# EAGLE design tdlf_server (EAGLE 9.6.2)
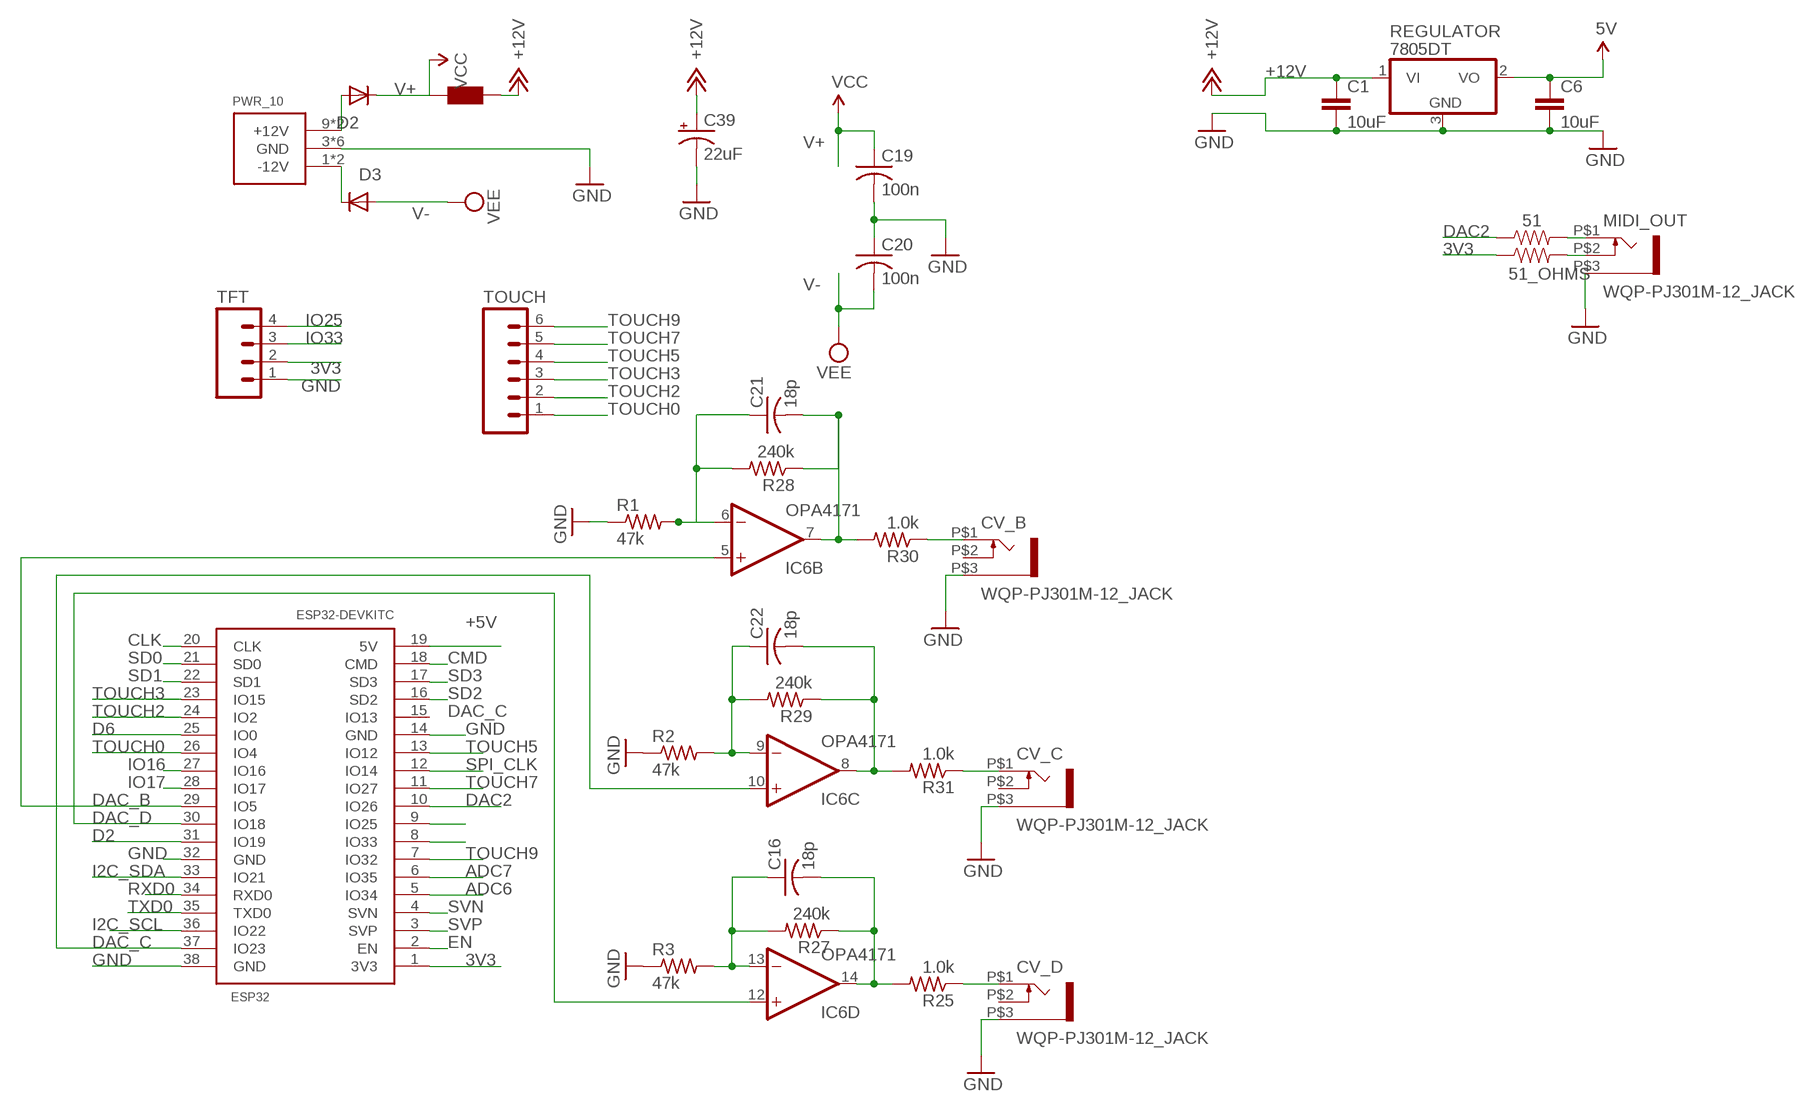
[diagram p0: schematic, sheet 1]

## Parts
51  RESISTOR1206  [1206]
51_OHMS  RESISTOR1206  [1206]
C1  10uF  CAPACITOR1210  [R1210]
C6  10uF  CAPACITOR1210  [R1210]
C16  18p  C-USC0603  [C0603]
C19  100n  C-USC0603  [C0603]
C20  100n  C-USC0603  [C0603]
C21  18p  C-USC0603  [C0603]
C22  18p  C-USC0603  [C0603]
C39  22uF  CAP_POL1206_TANT  [1206_POL]
CV_B  WQP-PJ301M-12_JACK  [WQP-PJ301M-12_JACK]
CV_C  WQP-PJ301M-12_JACK  [WQP-PJ301M-12_JACK]
CV_D  WQP-PJ301M-12_JACK  [WQP-PJ301M-12_JACK]
D2  B0450  DIODE-SOD123  [SOD123]
D3  B0540  DIODE-SOD123  [SOD123]
ESP32  ESP32DEVKITC  [ESP32-DEVKITC]
F1  Würth Electronics 742792664  FERRITE-BEAD0805  [R0805]
IC6  OPA4171  TL074D  [SO14]
MIDI_OUT  WQP-PJ301M-12_JACK  [WQP-PJ301M-12_JACK]
PWR_10  POWER_SIMPLE10  [POWER_10]
R1  47k  R-US_R1206  [R1206]
R2  47k  R-US_R1206  [R1206]
R3  47k  R-US_R1206  [R1206]
R25  1.0k  R-US_R0603  [R0603]
R27  240k  R-US_R0603  [R0603]
R28  240k  R-US_R0603  [R0603]
R29  240k  R-US_R0603  [R0603]
R30  1.0k  R-US_R0603  [R0603]
R31  1.0k  R-US_R0603  [R0603]
REGULATOR  7805DT  [TO252]
TFT  M04PTH  [1X04]
TOUCH  M06LOCK_LONGPADS  [1X06_LOCK_LONGPADS]

## Nets
3V: 51_OHMS.2 MIDI_OUT.P$2
3V3: 51_OHMS.1 ESP32.1(3V3) TFT.2
+5V: C6.1 ESP32.19(5V) REGULATOR.2(VO) ; supply symbol labelled 5V
+12V: C1.1 C39.2(+) F1.1 REGULATOR.1(VI)
ADC6: ESP32.5(IO34)
ADC7: ESP32.6(IO35)
CLK: ESP32.20(CLK)
CMD: ESP32.18(CMD)
D2: ESP32.31(IO19)
D6: ESP32.25(IO0)
DAC2: 51.1 ESP32.10(IO26)
DAC_B: ESP32.29(IO5) IC6.5(B:+IN)
DAC_C: ESP32.37(IO23) IC6.10(C:+IN)
DAC_D: ESP32.30(IO18) IC6.12(D:+IN)
EN: ESP32.2(EN)
GND: C1.2 C6.2 C19.2 C20.1 C39.1(-) CV_B.P$3 CV_C.P$3 CV_D.P$3 ESP32.14(GND) ESP32.32(GND) ESP32.38(GND) MIDI_OUT.P$3 PWR_10.3(GND) PWR_10.4(GND) PWR_10.5(GND) PWR_10.6(GND) PWR_10.7(GND) PWR_10.8(GND) R1.1 R2.1 R3.1 REGULATOR.3(GND) TFT.1
I2C_SCL: ESP32.36(IO22)
I2C_SDA: ESP32.33(IO21)
IO16: ESP32.27(IO16)
IO17: ESP32.28(IO17)
IO25: ESP32.9(IO25) TFT.4
IO33: ESP32.8(IO33) TFT.3
N$1: D3.C PWR_10.1(-12V) PWR_10.2(-12V)
N$2: C22.1 IC6.9(C:-IN) R2.2 R29.2
N$3: CV_C.P$1 R31.1
N$4: D2.A PWR_10.9(+12V) PWR_10.10(+12V)
N$5: CV_D.P$1 R25.1
N$50: C21.2 IC6.7(B:OUT) R28.1 R30.2
N$51: C22.2 IC6.8(C:OUT) R29.1 R31.2
N$52: C16.2 IC6.14(D:OUT) R25.2 R27.1
N$59: C16.1 IC6.13(D:-IN) R3.2 R27.2
N$60: C21.1 IC6.6(B:-IN) R1.2 R28.2
N$63: CV_B.P$1 R30.1
PIN27: 51.2 MIDI_OUT.P$1
RXD0: ESP32.34(RXD0)
SD0: ESP32.21(SD0)
SD1: ESP32.22(SD1)
SD2: ESP32.16(SD2)
SD3: ESP32.17(SD3)
SPI_CLK: ESP32.12(IO14)
SVN: ESP32.4(SVN)
SVP: ESP32.3(SVP)
TOUCH0: ESP32.26(IO4) TOUCH.1
TOUCH2: ESP32.24(IO2) TOUCH.2
TOUCH3: ESP32.23(IO15) TOUCH.3
TOUCH5: ESP32.13(IO12) TOUCH.4
TOUCH7: ESP32.11(IO27) TOUCH.5
TOUCH9: ESP32.7(IO32) TOUCH.6
TXD0: ESP32.35(TXD0)
V+: C19.1 D2.C F1.2 ; supply symbol labelled VCC
V-: C20.2 D3.A ; supply symbol labelled VEE
Unconnected: CV_B.P$2 CV_C.P$2 CV_D.P$2 ESP32.15(IO13) IC6.1(A:OUT) IC6.2(A:-IN) IC6.3(A:+IN)

## Power pins joined to a net without a drawn wire
V+: IC6.4(P:V+)
V-: IC6.11(P:V-)

## Library data of the parts
51 51_OHMS = SparkFun-Resistors:RESISTOR: Generic Resistor Package
C1 C6 = parts_aman:CAPACITOR
C16 C19-C22 = rcl:C-US: CAPACITOR, American symbol
C39 = parts_aman:CAP_POL
CV_B CV_C CV_D MIDI_OUT = thonkiconn:WQP-PJ301M-12_JACK
D2 D3 = diode:DIODE-: DIODE
ESP32 = ESP32-DEVKITC:ESP32DEVKITC
F1 = parts_aman:FERRITE-BEAD
IC6 = gm-ics:TL074: OP AMP
PWR_10 = parts_aman:POWER_SIMPLE
R1-R3 = rcl:R-US_: RESISTOR, American symbol; SPICEPREFIX: R
R25 R27-R31 = rcl:R-US_: RESISTOR, American symbol
REGULATOR = linear:78*: Positive VOLTAGE REGULATOR Source: http://cache.national.com/ds/LM/LM78L05.pdf http://www.fairchildsemi.com/ds/LM/LM7805.pdf
TFT = SparkFun-Connectors:M04: Header 4 Standard 4-pin 0.1" header. Use with straight break away headers (SKU : PRT-00116), right angle break away headers (PRT-00553), swiss pins (PRT-00743), machine pins (PRT-00117), and female headers (PRT-00115). Molex polarized connector foot print use with SKU : PRT-08231 with associated crimp pins and housings. 1MM SMD Version SKU: PRT-10208
TOUCH = SparkFun-Connectors:M06: Header 6 Standard 6-pin 0.1" header. Use with straight break away headers (SKU : PRT-00116), right angle break away headers (PRT-00553), swiss pins (PRT-00743), machine pins (PRT-00117), and female headers (PRT-00115). Molex polarized connector foot print use with SKU : PRT-08094 with associated crimp pins and housings. NOTES ON THE VARIANTS LOCK and LOCK_LONGPADS... This footprint was designed to help hold the alignment of a through-hole component (i.e. 6-pin header) while soldering it into place. You may notice that each hole has been shifted either up or down by 0.005 of an inch from it's more standard position (which is a perfectly straight line). This slight alteration caused the pins (the squares in the middle) to touch the edges of the holes. Because they are alternating, it causes a "brace" to hold the component in place. 0.005 has proven to be the perfect amount of "off-center" position when using our standard breakaway headers. Although looks a little odd when you look at the bare footprint, once you have a header in there, the alteration is very hard to notice. Also,if you push a header all the way into place, it is covered up entirely on the bottom side. This idea of altering the position of holes to aid alignment will be further integrated into the Sparkfun Library for other footprints. It can help hold any component with 3 or more connection pins.

## Board
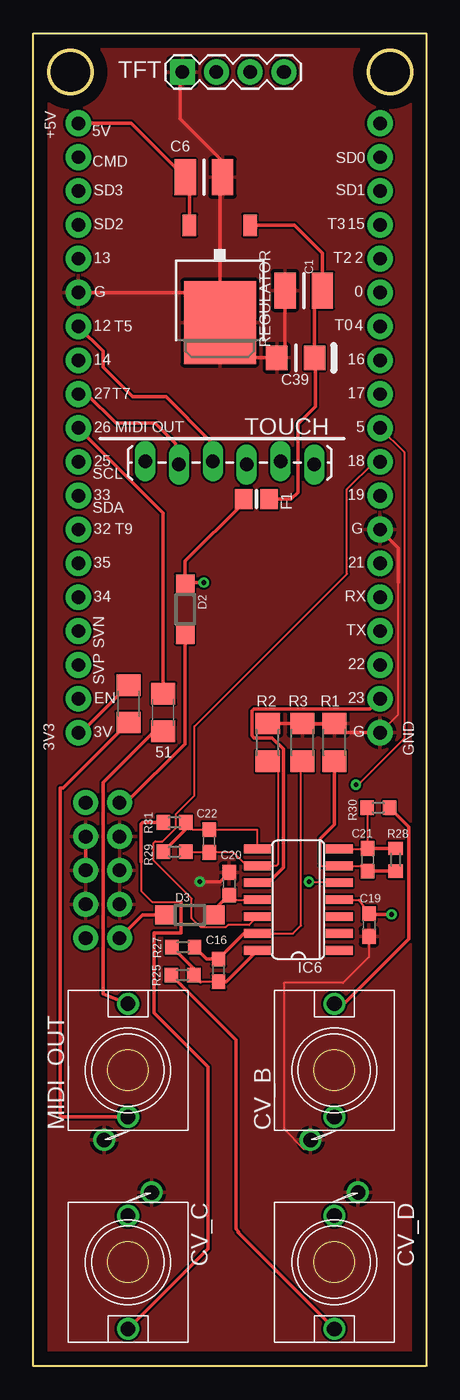
[diagram p1: board, top side]
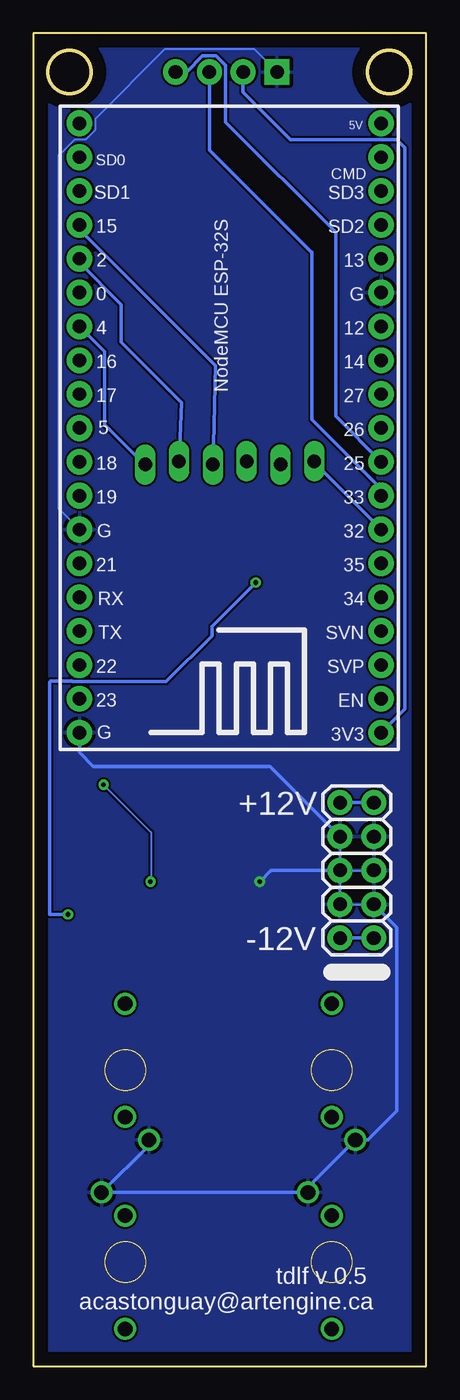
[diagram p2: board, bottom side, seen from below]

Size 29.5 x 100 mm. Coordinates in mm from the lower left corner, seen from the top.
Outline: 0,0 0,100 29.5,100 29.5,0 0,0
Outline: circle at 26.8,97.1 radius 1.62
Outline: circle at 2.8,97.1 radius 1.62
Copper layers (1*16): Top 0.035mm / dielectric 1.5mm / Bottom 0.035mm
Design rules "default": minimum track width 6mil, minimum drill 0.35mm, track to track 6mil, track to pad 6mil, pad to pad 6mil, via to via 6mil, smd to smd 6mil, copper to edge 40mil, drill to drill 6mil, minimum pad ring 10mil, minimum via ring 8mil, stop-mask expansion 4mil, vias tented up to drill 0mil, thermal gap 10mil

### Footprints (pad centres in the part's own frame; a part is rotated, then mirrored left to right if it is on the bottom)
1206 = smd 1.6 x 1.8: 1 -1.4,0; 2 1.4,0
R1210 = smd 1.6 x 2.7: 1 -1.4,0; 2 1.4,0
C0603 = smd 1.1 x 1: 1 -0.85,0; 2 0.85,0
1206_POL = smd 1.6 x 1.803: 1 -1.422,0; 2 1.422,0
WQP-PJ301M-12_JACK = drill 1.1: P$1 0,5; P$2 0,-3.5; P$3 -1.778,-5.23
SOD123 = smd 1.4 x 1.4: A 1.9,0; C -1.9,0
ESP32-DEVKITC = drill 1 pad 1.93: 1 -22.87,-11.42; 2 -20.33,-11.42; 3 -17.79,-11.42; 4 -15.25,-11.42; 5 -12.71,-11.42; 6 -10.17,-11.42; 7 -7.63,-11.42; 8 -5.09,-11.42; 9 -2.55,-11.42; 10 -0.01,-11.42; 11 2.53,-11.42; 12 5.07,-11.42; 13 7.61,-11.42; 14 10.15,-11.42; 15 12.69,-11.42; 16 15.23,-11.42; 17 17.77,-11.42; 18 20.31,-11.42; 19 22.85,-11.42; 20 22.85,11.23; 21 20.31,11.23; 22 17.77,11.23; 23 15.23,11.23; 24 12.69,11.23; 25 10.15,11.23; 26 7.61,11.23; 27 5.07,11.23; 28 2.53,11.23; 29 -0.01,11.23; 30 -2.55,11.23; 31 -5.09,11.23; 32 -7.63,11.23; 33 -10.17,11.23; 34 -12.71,11.23; 35 -15.25,11.23; 36 -17.79,11.23; 37 -20.33,11.23; 38 -22.87,11.23
R0805 = smd 1.3 x 1.5: 1 -0.95,0; 2 0.95,0
SO14 = smd 0.66 x 2.032: 1 -3.81,-3.073; 2 -2.54,-3.073; 3 -1.27,-3.073; 4 0,-3.073; 5 1.27,-3.073; 6 2.54,-3.073; 7 3.81,-3.073; 8 3.81,3.073; 9 2.54,3.073; 10 1.27,3.073; 11 0,3.073; 12 -1.27,3.073; 13 -2.54,3.073; 14 -3.81,3.073
POWER_10 = drill 1.016 pad 1.88: 1 -5.08,-1.27; 2 -5.08,1.27; 3 -2.54,-1.27; 4 -2.54,1.27; 5 0,-1.27; 6 0,1.27; 7 2.54,-1.27; 8 2.54,1.27; 9 5.08,-1.27; 10 5.08,1.27
R1206 = smd 1.6 x 1.803: 1 -1.422,0; 2 1.422,0
R0603 = smd 1 x 1.1: 1 -0.85,0; 2 0.85,0
TO252 = smd 1 x 1.6: 1 -2.28,-4.8; 2 2.28,-4.8 | smd 5.4 x 6.2: 3 0,2.5
1X04 = drill 1.016 pad 1.88 square: 1 0,0 | drill 1.016 pad 1.88: 2 2.54,0; 3 5.08,0; 4 7.62,0
1X06_LOCK_LONGPADS = drill 1.016 long: 1 0,0; 2 2.54,-0.254; 3 5.08,0; 4 7.62,-0.254; 5 10.16,0; 6 12.7,-0.254

### Placement (x,y rotation side)
51  9.75,49.05 270 top
51_OHMS  7.15,49.7 270 top
C1  20.3,80.7 180 top
C6  12.8,89.2 0 top
C16  13.9,29.7 270 top
C19  25.2,33.1 270 top
C20  14.7,36.2 270 top
C21  25.1,38 90 top
C22  13.2,39.4 90 top
C39  19.7,75.65 0 top
CV_B  22.6,22.2 0 top
CV_C  7.1,7.8 180 top
CV_D  22.6,7.8 180 top
D2  11.4,56.8 270 top
D3  11.75,33.85 0 top
ESP32  14.8,70.4 90 bottom
F1  16.75,65.05 180 top
IC6  19.9,35 90 top
MIDI_OUT  7.1,22.2 0 top
PWR_10  5.2,37.2 90 bottom
R1  22.6,46.8 270 top
R2  17.6,46.8 270 top
R3  20.2,46.8 270 top
R25  11.2,29.35 0 top
R27  11.25,31.45 0 top
R28  27.2,38 270 top
R29  10.6,38.6 0 top
R30  25.9,41.9 180 top
R31  10.6,40.8 0 top
REGULATOR  14,80.8 180 top
TFT  11.2,97.1 0 top
TOUCH  21.1,67.65 180 top

### Tracks (layer width: path | path; a pad name or v marks a point on that pad's centre or on a via)
3V
  Top 0.254: MIDI_OUT.P$2 2.15,18.7 2.05,18.65 2,18.7 2,43.4 2.25,43.4 51_OHMS.2
3V3
  Top 0.254: 51_OHMS.1 3.58,47.53 ESP32.1
  Bottom 0.254: TFT.2 13.74,95.56 10.18,92 2.21,92 1.6,91.4 1.6,49.31 ESP32.1
+5V
  Top 0.254: REGULATOR.2 11.72,88.88 C6.1 7.35,93.25 ESP32.19
+12V
  Top 0.254: F1.1 19.35,65.05 19.85,65.55 19.85,70.68 21.17,72 21.17,75.6 C39.2 21.12,80.12 C1.1 21.7,83.5 19.6,85.6 REGULATOR.1
DAC2
  Top 0.254: ESP32.10 9.75,64.02 51.1
DAC_B  (via drill 0.35)
  Top 0.152: ESP32.29 27.85,68.57 27.85,47.1 24.3,43.55 v24.23,43.62 | v20.71,36.35 22.89,36.35 IC6.5
  Bottom 0.152: v24.23,43.62 20.65,40.05 20.65,36.35 v20.71,36.35
DAC_C
  Top 0.254: ESP32.37 25.26,49.3 16.58,49.3 16.42,49.14 16.42,47.31 16.58,47.14 17.93,47.14 18.78,46.29 18.78,37.43 17.55,36.2 16.9,36.2 IC6.10
DAC_D
  Top 0.152: IC6.12 16.2,33.1 14.62,33.1 14.45,32.92 12.58,32.92 11.89,33.61 11.89,35.08 9.02,37.95 9.02,39.24 9.15,39.38 9.7,39.38 10.72,40.4 10.72,41.45 12.1,42.82 12.1,48 23.55,59.45 23.55,65.8 25.6,67.85 ESP32.30
GND  (via drill 0.35)
  Top 0.152: 27.4,58.8 27.4,48.9 ESP32.38 | C19.2 25.2,30.7 23.25,28.75 18.8,28.75 18.8,17.8 20.33,16.27 CV_B.P$3
  Top 0.254: PWR_10.5 PWR_10.7 | C39.1 16.65,75.65 REGULATOR.3 | REGULATOR.3 14,80.3 | 14,80.3 14,89 C6.2 14.2,90.4 11,93.6 11,96.9 TFT.1 | C39.1 18.9,76.27 C1.2 | C39.1 14.5,75.65 | C20.1 14,36.35 v12.5,36.35 | ESP32.14 13.75,80.55 14,80.3 | REGULATOR.3 14.75,77.55 | R2.1 R3.1 20.2,48.2 | 27.4,58.8 27.4,61.4 ESP32.32 | 20.2,47.9 20.2,48.2 | 20.2,48.2 22.58,48.2 R1.1 23.29,47.53 ESP32.38
  Bottom 0.152: PWR_10.8 PWR_10.6 | PWR_10.6 PWR_10.5 | PWR_10.6 6.47,35.85 6.54,35.78 6.47,35.71 PWR_10.4 PWR_10.3 | ESP32.32 27.6,64.34 27.6,90.83 26.37,92.06 25.54,92.06 24.84,92.76 24.84,93.59 19.6,98.83 12.93,98.83 TFT.1
  Bottom 0.254: PWR_10.3 2.2,32.93 2.2,19.17 4.4,16.97 MIDI_OUT.P$3 8.88,13.41 CV_C.P$3 CV_D.P$3 20.82,16.59 CV_B.P$3 | PWR_10.8 11.73,45 25,45 26.03,46.03 ESP32.38 | PWR_10.6 11.65,37.2 v12.5,36.35 12.55,36.3
  pour Bottom: 29,99.8 29.4,99.8 29.4,1 29.5,0.3 0.7,0.3 0.3,0.5 0.2,99.8
  pour Top: 0.5,99.7 29.29,99.7 29.29,0.3 0.3,0.3 0.3,99.7 0.5,99.9
IO25
  Bottom 0.254: ESP32.9 6.8,71.27 6.8,85.08 15.06,93.34 15.06,97.61 15.78,98.32 16.79,98.32 18,97.1 TFT.4
IO33
  Bottom 0.254: ESP32.8 3.38,65.81 8.6,71.03 8.6,83.45 8.6,83.55 | 8.6,83.6 8.6,83.55 | TFT.3 16.28,91.23 8.6,83.55
N$1
  Top 0.254: PWR_10.2 8.2,33.85 8.45,33.85 | 8.45,33.85 D3.C | 8.45,33.85
  Bottom 0.254: PWR_10.1 PWR_10.2
N$2
  Top 0.152: R2.2 18.35,44.63 18.35,37.65 18.24,37.54 IC6.9 16.03,37.54 15.02,38.55 C22.1 11.5,38.55 R29.2
N$3
  Top 0.152: 8.1,37.85 8.1,35.65 8.9,34.85 11.1,34.85
  Top 0.254: R31.1 8.2,40.8 8.1,40.7 8.1,37.85 | 11.1,34.85 11.1,32.5 9.05,32.5 9.05,26.5 13.1,22.45 13.1,8.8 CV_C.P$1
N$4
  Top 0.254: D2.A 11.4,46.7 6.98,42.28 PWR_10.10
  Bottom 0.254: PWR_10.10 PWR_10.9
N$5
  Top 0.254: R25.1 15.2,24.5 15.2,10.3 15.4,10.1 15.36,10.04 CV_D.P$1
N$50
  Top 0.152: IC6.7 25.06,38.81 | R30.2 25.1,41.85 C21.2
  Top 0.254: R28.1 C21.2 25.06,38.81
N$51
  Top 0.152: IC6.8 16.83,40.25 C22.2 12,40.25 R31.2
  Top 0.254: R31.2 11.45,40.3 R29.1
N$52
  Top 0.152: 12.55,28.85 C16.2 14.49,28.85
  Top 0.254: IC6.14 14.49,28.85 | 12.55,28.85 R25.2 12.05,29.8 R27.1
N$59
  Top 0.152: IC6.13 19.5,32.46 20.1,33.06 20.1,45.28 R3.2
  Top 0.254: 16.67,32.3 IC6.13 15.81,32.46 C16.1 13,30.55 R27.2
N$60
  Top 0.152: C21.1 24.71,37.54 IC6.6 21.56,37.54 21.55,37.55 21.55,39.58
  Top 0.254: R28.2 C21.1 | R1.2 22.6,40.63 21.55,39.58
N$63
  Top 0.152: R30.1 26.82,41.83 27.2,41.45
  Top 0.254: CV_B.P$1 23.3,27.2 23.32,27.17 28.2,32.05 28.2,40.45 26.82,41.83
PIN27
  Top 0.254: 51.2 9.12,47.65 5.25,43.78 5.25,27.95 MIDI_OUT.P$1
TOUCH0
  Bottom 0.254: ESP32.26 24.15,76.13 24.15,70.65 21.15,67.65 TOUCH.1
TOUCH2
  Bottom 0.254: ESP32.24 26.03,82.79 22.9,79.66 22.9,76.84 18.36,72.3 TOUCH.2
TOUCH3
  Bottom 0.254: ESP32.23 26.03,85.28 15.82,75.07 TOUCH.3
TOUCH5
  Top 0.254: ESP32.13 5.25,76.14 5.25,74.95 7.45,72.75 9.95,72.75 13.28,69.42 TOUCH.4
TOUCH7
  Top 0.254: ESP32.11 4.02,72.93 6.2,70.75 9.15,70.75 10.69,69.21 10.69,67.7 TOUCH.5
TOUCH9
  Bottom 0.254: ESP32.7 8.2,67.59 TOUCH.6
V+  (via drill 0.35)
  Top 0.152: IC6.4 24.45,35 C19.1
  Top 0.254: F1.2 15.8,64.8 11.4,60.4 D2.C 11.5,58.8 v12.8,58.8 | v26.9,33.9 25.25,33.9 C19.1
  Bottom 0.254: v12.8,58.8 16.1,55.5 16.1,54.8 19.54,51.37 26.55,51.37 26.58,51.4 28.2,51.4 28.28,51.32 28.28,33.9 v26.9,33.9
V-
  Top 0.152: IC6.11 16.78,34.95 15.1,34.95 C20.2
  Top 0.254: C20.2 13.65,34.3 D3.A

### Text on the board
tPlace: 3V3
tNames: +5V | T3 | T2 | T5 | T0 | T7 | MIDI OUT | SCL | SDA | T9 | GND
bNames: +12V | -12V | tdlf v 0.5 / acastonguay@artengine.ca